# Altium schematic sheet V1.0.SchDoc
size 111 x 76 mm
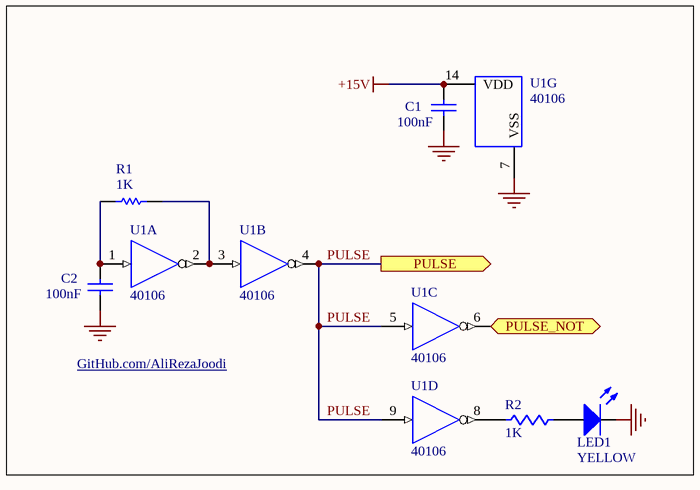
[diagram p0: V1.0.SchDoc]

## Parts
C1  100nF  [CAPNTO2.54-3.05x1.78A]
C2  100nF  [CAPNTO5.08-7.37x3.94]
LED1  YELLOW  [LED-5mm_Red]
R1  1K  [AXIAL-0.4]
R2  1K  [AXIAL-0.4]
U1  40106  [DIP14]  (parts A,B,C,D,G of 7)

## Ports
PULSE (out), PULSE_NOT (out)

## Nets
+15V: C1.2 U1.14(VDD)
GND: C1.1 C2.1 LED1.2(K) U1.7(VSS)
PULSE: U1.4(~{O}) U1.5(I) U1.9(I) ; port PULSE
PULSE_NOT: U1.6(~{O}) ; port PULSE_NOT
NetC2_2: C2.2 R1.2 U1.1(I)
NetLED1_1: LED1.1(A) R2.2
NetR1_1: R1.1 U1.2(~{O}) U1.3(I)
NetR2_1: R2.1 U1.8(~{O})

## Notes on the sheet
- GitHub.com/AliRezaJoodi

## Library data of the parts
C1 = Cap: Capacitor; Manufacturer: Generic Components; Class I: Passive; Published: 8-Jun-2000; Revision: July-2002: Re-released for DXP Platform.; Publisher: Altium Limited; Class II: Capacitor
C2 = Cap: Capacitor; Published: 8-Jun-2000; LatestRevisionDate: 17-Jul-2002; LatestRevisionNote: Re-released for DXP Platform.; PackageReference: RAD-0.3; Publisher: Altium Limited
LED1 = LED: Typical INFRARED GaAs LED; Manufacturer: Generic Components; Class I: Optoelectronic; Published: 8-Jun-2000; Revision: July-2002: Re-released for DXP Platform.; Publisher: Altium Limited; Class II: LED
R1 = Res1: Resistor; Published: 8-Jun-2000; LatestRevisionDate: 17-Jul-2002; LatestRevisionNote: Re-released for DXP Platform.; PackageReference: AXIAL-0.3; Publisher: Altium Limited
R2 = Res1: Resistor; Manufacturer: Generic Components; Class I: Passive; Published: 8-Jun-2000; Revision: July-2002: Re-released for DXP Platform.; Publisher: Altium Limited; Class II: Resistor
U1 = 40106: Hex inverting Schmitt trigger, 14-Pin; Publisher: Altium Limited; ComponentLink1URL: http://www.nxp.com